# EAGLE design board (EAGLE 9.6.2)
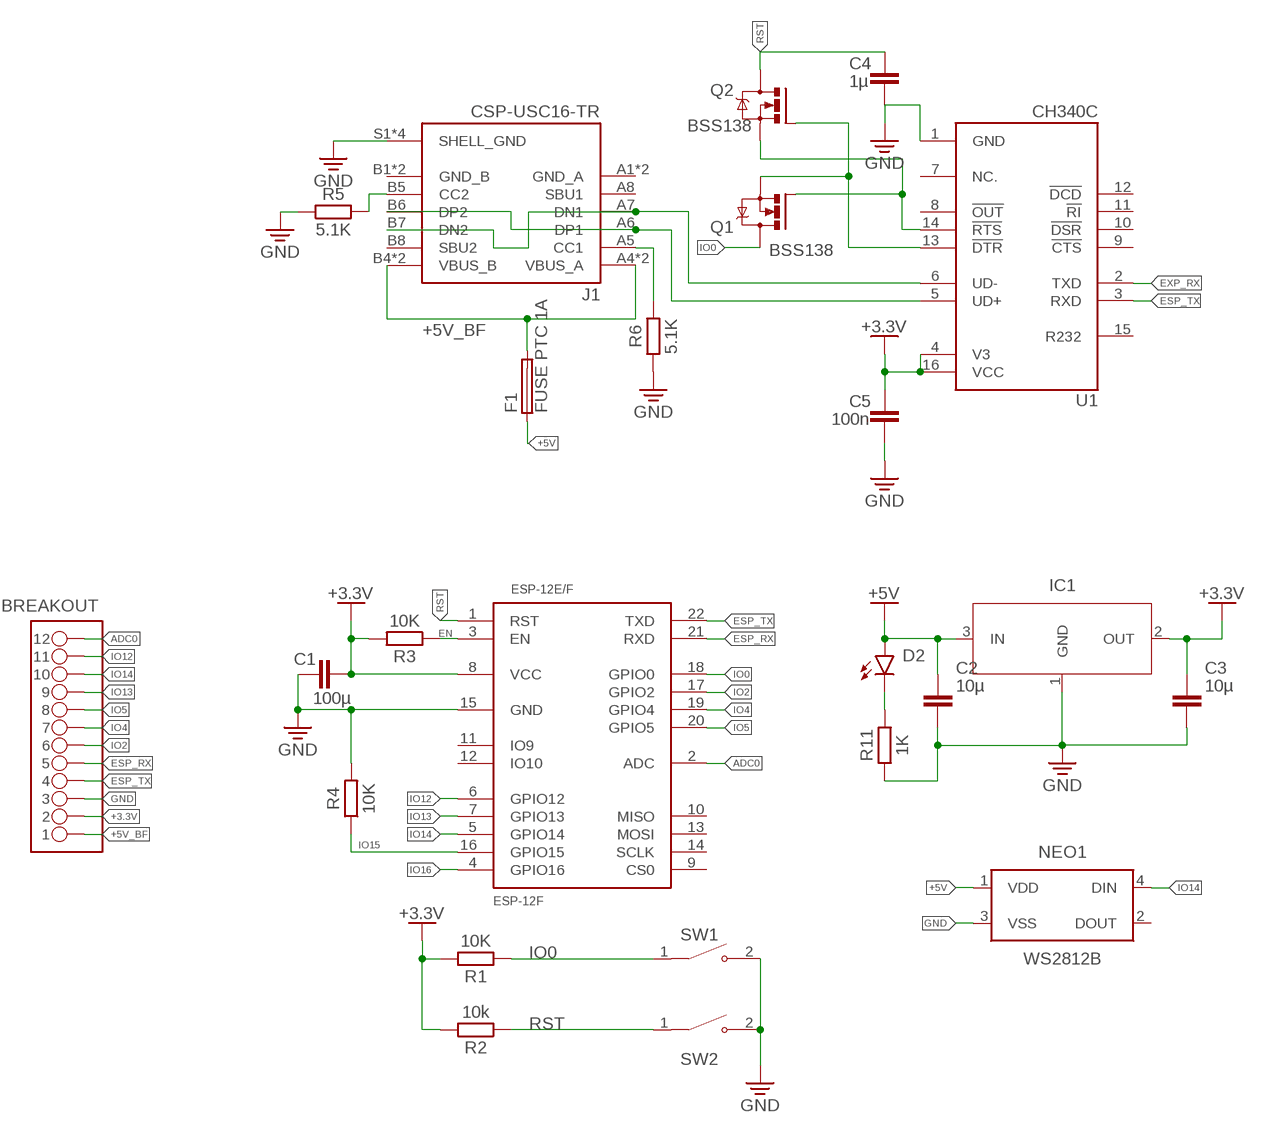
[diagram p0: schematic, sheet 1]

## Parts
BREAKOUT  PINHD-1X12-BACKUP_1X12M  [1X12]
C1  100µ  C_TANTALUM-2412(6032-METRIC)  [CAPM6032X280]
C2  10µ  C_CHIP-0805(2012-METRIC)  [CAPC2012X110]
C3  10µ  C_CHIP-0805(2012-METRIC)  [CAPC2012X110]
C4  1µ  C_CHIP-0805(2012-METRIC)  [CAPC2012X110]
C5  100n  C_CHIP-0805(2012-METRIC)  [CAPC2012X110]
D2  LED_RED  CHIP-FLAT-R_0805  [LEDC2012X110N_FLAT-R]
ESP-12E/F  ESP-12F  [ESP-12F]
F1  FUSE PTC 1A  FUSE_CHIP-1206(3216-METRIC)  [FUSC3215X82N]
IC1  NCP1117ST33T3G  NCP1117ST33T3GSOT-223  [SOT230P700X170-4]
J1  CSP-USC16-TR  [VALCON_CSP-USC16-TR]
NEO1  WS2812B  [WS2812B]
Q1  BSS138  NMOSFETSOT23-GSD  [SOT23]
Q2  BSS138  NMOSFETSOT23-GSD  [SOT23]
R1  10K  R_CHIP-0805(2012-METRIC)  [RESC2012X65]
R2  10k  R_CHIP-0805(2012-METRIC)  [RESC2012X65]
R3  10K  R_CHIP-0805(2012-METRIC)  [RESC2012X65]
R4  10K  R_CHIP-0805(2012-METRIC)  [RESC2012X65]
R5  5.1K  R_CHIP-0805(2012-METRIC)  [RESC2012X65]
R6  5.1K  R_CHIP-0805(2012-METRIC)  [RESC2012X65]
R11  1K  R_CHIP-0805(2012-METRIC)  [RESC2012X65]
SW1  SWITCH-2P  [SWITCH-2P]
SW2  SWITCH-2P  [SWITCH-2P]
U1  CH340C  [SOIC127P600X180-16N]

## Nets
+3.3V: BREAKOUT.2 C1.2 C3.1 C5.1 ESP-12E/F.8(VCC) IC1.2(OUT) R1.2 R2.2 R3.2 U1.4(V3) U1.16(VCC)
+5V: C2.1 D2.A F1.1 IC1.3(IN) NEO1.1(VDD)
+5V_BF: BREAKOUT.1 F1.2 J1.A4(VBUS_A) J1.A9(VBUS_A) J1.B4(VBUS_B) J1.B9(VBUS_B)
ADC0: BREAKOUT.12 ESP-12E/F.2(ADC)
EN: ESP-12E/F.3(EN) R3.1
ESP_RX: BREAKOUT.5 ESP-12E/F.21(RXD)
ESP_TX: BREAKOUT.4 ESP-12E/F.22(TXD) U1.3(RXD)
EXP_RX: U1.2(TXD)
GND: BREAKOUT.3 C1.1 C2.2 C3.2 C4.2 C5.2 ESP-12E/F.15(GND) IC1.1(GND) J1.S1(SHELL_GND) J1.S2(SHELL_GND) J1.S3(SHELL_GND) J1.S4(SHELL_GND) NEO1.3(VSS) R4.2 R5.1 R6.1 R11.1 SW1.2 SW2.2 U1.1(GND)
IO0: ESP-12E/F.18(GPIO0) Q1.3(D) R1.1 SW1.1
IO2: BREAKOUT.6 ESP-12E/F.17(GPIO2)
IO4: BREAKOUT.7 ESP-12E/F.19(GPIO4)
IO5: BREAKOUT.8 ESP-12E/F.20(GPIO5)
IO12: BREAKOUT.11 ESP-12E/F.6(GPIO12)
IO13: BREAKOUT.9 ESP-12E/F.7(GPIO13)
IO14: BREAKOUT.10 ESP-12E/F.5(GPIO14) NEO1.4(DIN)
IO15: ESP-12E/F.16(GPIO15) R4.1
IO16: ESP-12E/F.4(GPIO16)
N$1: J1.A6(DP1) J1.B6(DP2) U1.5(UD+)
N$2: J1.A7(DN1) J1.B7(DN2) U1.6(UD-)
N$4: Q1.2(S) Q2.1(G) U1.13(!DTR)
N$5: J1.B5(CC2) R5.2
N$6: J1.A5(CC1) R6.2
N$8: Q1.1(G) Q2.2(S) U1.14(!RTS)
N$9: D2.C R11.2
RST: C4.1 ESP-12E/F.1(RST) Q2.3(D) R2.1 SW2.1
Unconnected: ESP-12E/F.9(CS0) ESP-12E/F.10(MISO) ESP-12E/F.11(IO9) ESP-12E/F.12(IO10) ESP-12E/F.13(MOSI) ESP-12E/F.14(SCLK) J1.A8(SBU1) J1.B8(SBU2) NEO1.2(DOUT) U1.7(NC.) U1.8(!OUT) U1.9(!CTS) U1.10(!DSR) U1.11(!RI) U1.12(!DCD) U1.15(R232)

## Power pins joined to a net without a drawn wire
GND_A: J1.A1(GND_A) J1.A12(GND_A)
GND_B: J1.B1(GND_B) J1.B12(GND_B)

## Library data of the parts
BREAKOUT = Tinkercad:PINHD-1X12-BACKUP
C1-C5 = Capacitor:C: Capacitor - Generic; CATEGORY: Capacitor
D2 = LED:CHIP-FLAT-R; CATEGORY: LED; COLOR: RED; DESCRIPTION: CHIP LED FLAT; SUB-CATEGORY: CHIP; TYPE: FLAT_TOP
ESP-12E/F = WorTel2023:ESP-12F
F1 = Circuit-Protection:FUSE: Fuse - Generic; CATEGORY: Circuit-Protection; SUB-CATEGORY: Fuse
IC1 = IC_Power-Management:NCP1117ST33T3G: 1.0 A Low-Dropout Positive Fixed and Adjustable Voltage Regulators Datasheet <https://www.onsemi.com/pub/Collateral/NCP1117-D.PDF>; CATEGORY: IC_Power-Management; MANUFACTURER: ON Semiconductor; MPN: NCP1117ST33T3G; OPERATING_TEMP: 0 to +125 °C; PART_STATUS: Active; ROHS_COMPLIANT: RoHS3 Compliant; SERIES: NCP1117, NCV1117; SUB-CATEGORY: Voltage Regulator; TYPE: Linear
J1 = CSP-USC16-TR:CSP-USC16-TR: Check availability <https://pricing.snapeda.com/parts/CSP-USC16-TR/Valcon/view-part?ref=eda>; AVAILABILITY: In Stock; CHECK_PRICES: https://www.snapeda.com/parts/CSP-USC16-TR/Valcon/view-part/?ref=eda; DESCRIPTION: CSP-USC16-TR Valcon USB Type C Surface Mount PCB Socket; MF: Valcon; MP: CSP-USC16-TR; PACKAGE: None; PRICE: None; SNAPEDA_LINK: https://www.snapeda.com/parts/CSP-USC16-TR/Valcon/view-part/?ref=snap
NEO1 = LED:WS2812B: Intelligent control LED integrated light source Datasheet <http://cdn.sparkfun.com/datasheets/BreakoutBoards/WS2812B.pdf>; CATEGORY: LED; COLOR: RGB; DESCRIPTION: LED integrated light source; MANUFACTURER: Worldsemi; MPN: WS2812B; OPERATING_TEMP: -25 ℃ to +80℃(TJ); PART_STATUS: Active; SUB_CATEGORY: RGB
Q1 Q2 = Transistor:NMOSFET: N-Channel MOSFET - Generic; CATEGORY: Transistor; SUB-CATEGORY: MOSFET; TYPE: N-Channel; VALUE: NMOSFET
R1-R6 R11 = Resistor:R: Resistor Fixed - Generic; CATEGORY: Resistor; SUB-CATEGORY: Fixed
SW1 SW2 = WorTel2023:SWITCH-2P; MANUFACTURER: CUI Devices; MAXIMUM_PACKAGE_HEIGHT: 2.5 mm; PARTREV: 1.0; STANDARD: Manufacturer Recommendations
U1 = CH340C:CH340C: USB to serial chip CH340 Check availability <https://pricing.snapeda.com/parts/CH340C/WCH/view-part?ref=eda>; AVAILABILITY: Not in stock; CHECK_PRICES: https://www.snapeda.com/parts/CH340C/WCH/view-part/?ref=eda; DESCRIPTION: USB to serial chip CH340; MF: WCH; MP: CH340C; PACKAGE: None; PRICE: None; SNAPEDA_LINK: https://www.snapeda.com/parts/CH340C/WCH/view-part/?ref=snap

## Board
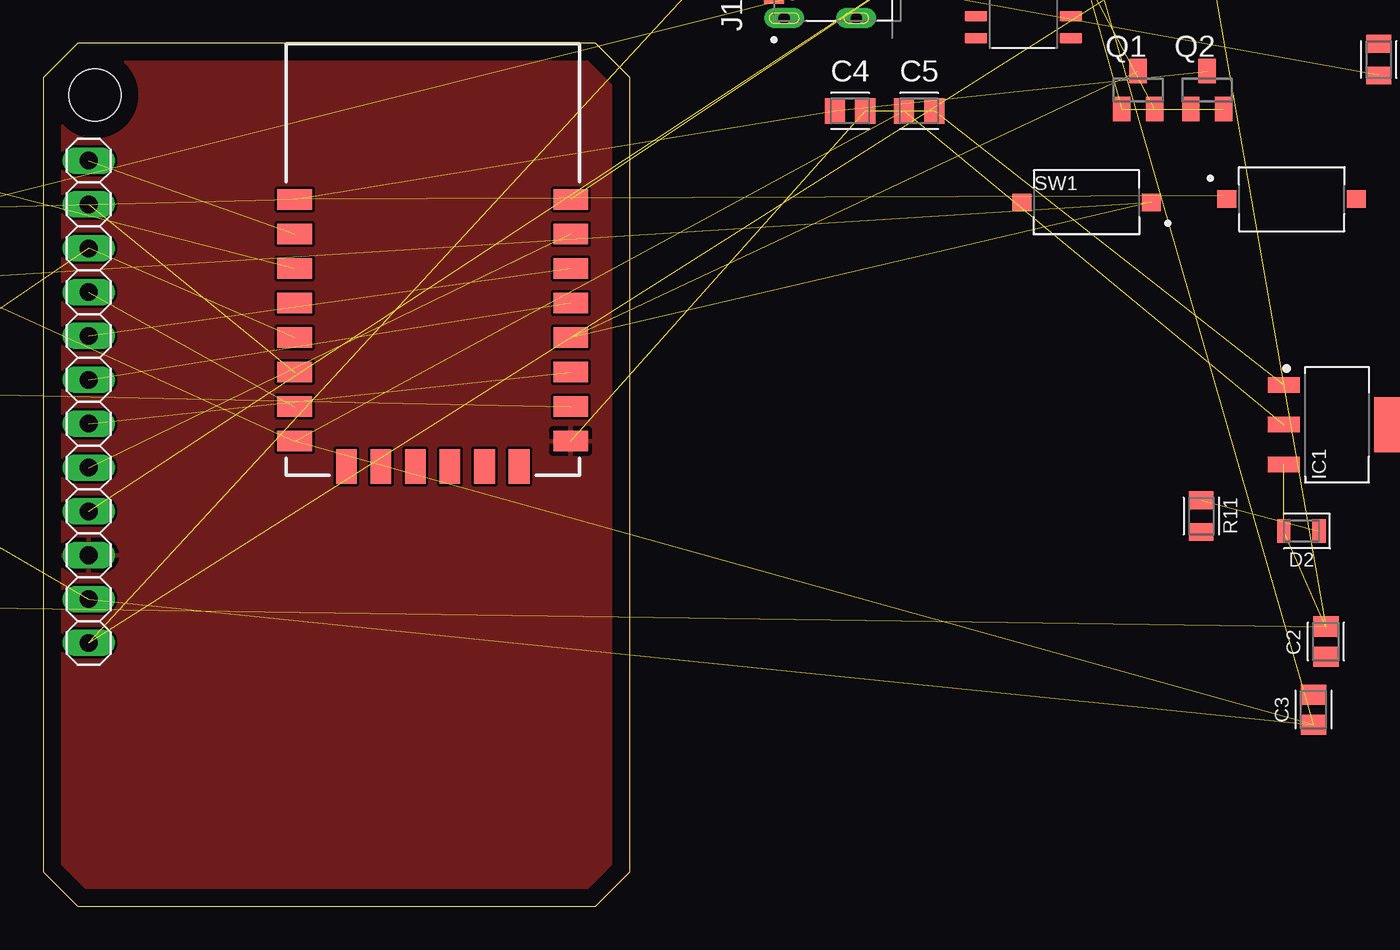
[diagram p1: board, top side]
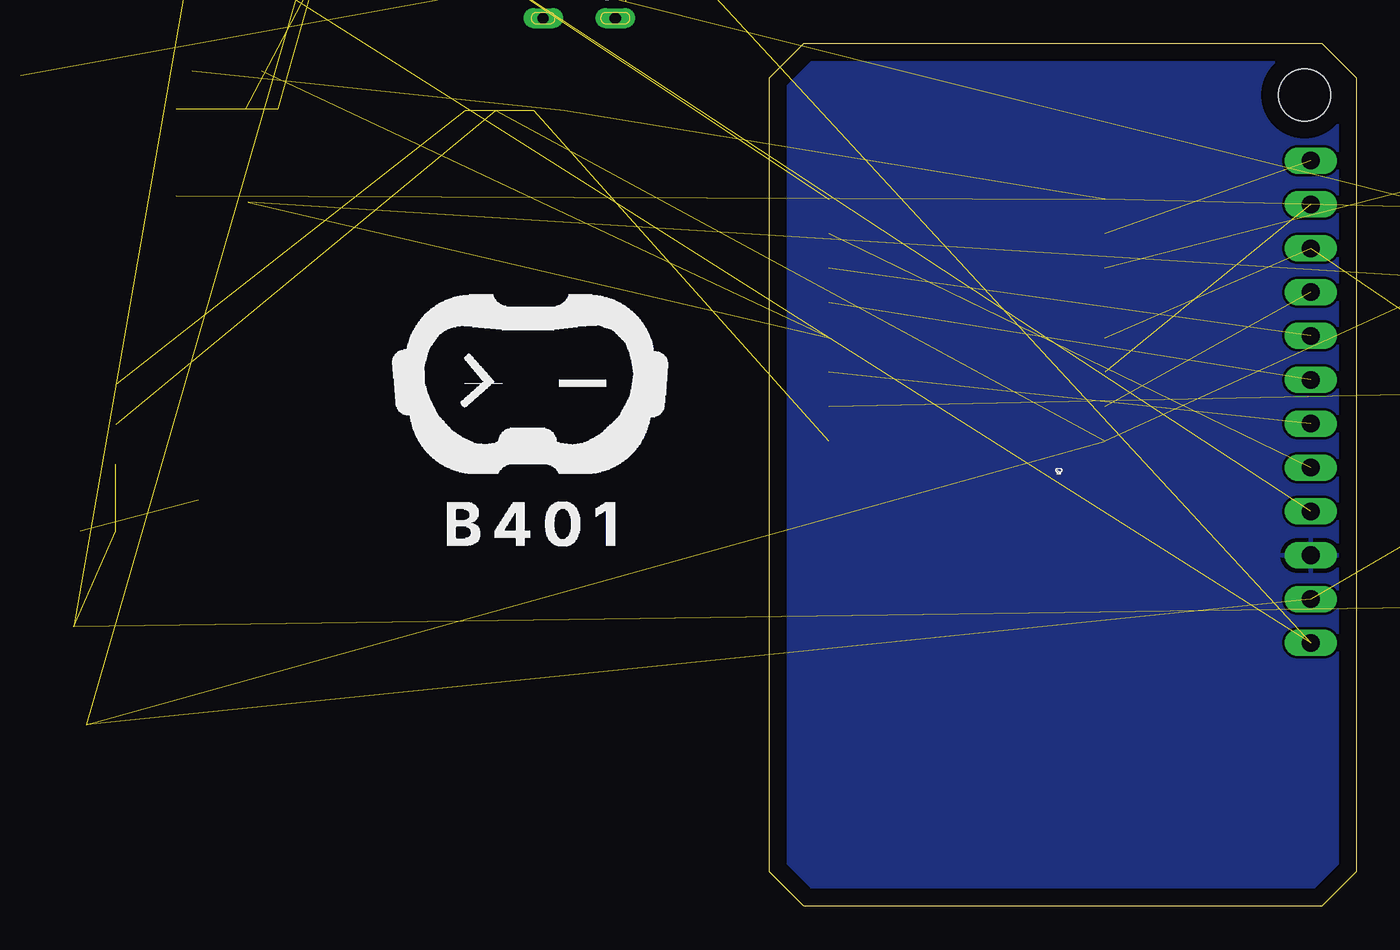
[diagram p2: board, bottom side, seen from below]

Size 34 x 50 mm. Coordinates in mm from the lower left corner, seen from the top.
Outline: 2,0 32,0 34,2 34,48 32,50 2,50 0,48 0,2 2,0
Copper layers (1*16): Top 0.035mm / dielectric 1.5mm / Bottom 0.035mm
Design rules "default *": minimum track width 6mil, minimum drill 0.3mm, track to track 6mil, track to pad 6mil, pad to pad 6mil, via to via 6mil, smd to smd 6mil, copper to edge 40mil, drill to drill 6mil, minimum pad ring 10mil, minimum via ring 8mil, stop-mask expansion 4mil, vias tented up to drill 0mil, thermal gap 10mil
Holes 3 mm at 3,47

### Footprints (pad centres in the part's own frame; a part is rotated, then mirrored left to right if it is on the bottom)
1X12 = drill 1.016 long: 1 -13.97,0; 2 -11.43,0; 3 -8.89,0; 4 -6.35,0; 5 -3.81,0; 6 -1.27,0; 7 1.27,0; 8 3.81,0; 9 6.35,0; 10 8.89,0; 11 11.43,0; 12 13.97,0
CAPM6032X280 = smd 2.368 x 2.204: 1 -2.471,0; 2 2.471,0
CAPC2012X110 = smd 1.165 x 1.465: 1 -0.875,0; 2 0.875,0
LEDC2012X110N_FLAT-R = smd 0.762 x 1.362: A 1.025,0; C -1.025,0
ESP-12F = smd 2 x 1.2: 1 -8,3.48; 2 -8,1.48; 3 -8,-0.52; 4 -8,-2.52; 5 -8,-4.52; 6 -8,-6.52; 7 -8,-8.52; 8 -8,-10.52; 15 8,-10.52; 16 8,-8.52; 17 8,-6.52; 18 8,-4.52; 19 8,-2.52; 20 8,-0.52; 21 8,1.48; 22 8,3.48 | smd 1.2 x 2: 9 -5,-12; 10 -3,-12; 11 -1,-12; 12 1,-12; 13 3,-12; 14 5,-12
FUSC3215X82N = smd 1.165 x 1.814: 1 -1.475,0; 2 1.475,0
SOT230P700X170-4 = smd 1.86 x 0.898: 1 -3.075,2.3; 2 -3.075,0; 3 -3.075,-2.3 | smd 1.86 x 3.189: 4 3.075,0
VALCON_CSP-USC16-TR = smd 0.3 x 1.14: A1 -3.35,0; A4 -2.55,0; A5 -1.25,0; A6 -0.25,0; A7 0.25,0; A8 1.25,0; A9 2.55,0; A12 3.35,0; B1 3.05,0; B4 2.25,0; B5 1.75,0; B6 0.75,0; B7 -0.75,0; B8 -1.75,0; B9 -2.25,0; B12 -3.05,0 | drill 0.65 pad 1 long: S1 -4.325,-0.59; S2 4.325,-0.59 | drill 0.65 pad 0.9 long: S3 -4.325,-4.77; S4 4.325,-4.77 | hole 0.65: -2.89,-1.07; 2.89,-1.07
WS2812B = smd 1.5 x 0.9: 1 -2.45,1.65; 2 -2.45,-1.65; 3 2.45,-1.65; 4 2.45,1.65
SOT23 = smd 1 x 1.4: 1 -0.95,-1.1; 2 0.95,-1.1; 3 0,1.1
RESC2012X65 = smd 1.031 x 1.42: 1 -0.919,0; 2 0.919,0
SWITCH-2P = smd 1.1 x 1: 1 -3.75,0; 2 3.75,0
SOIC127P600X180-16N = smd 1.31 x 0.62: 1 -2.75,4.445; 2 -2.75,3.175; 3 -2.75,1.905; 4 -2.75,0.635; 5 -2.75,-0.635; 6 -2.75,-1.905; 7 -2.75,-3.175; 8 -2.75,-4.445; 9 2.75,-4.445; 10 2.75,-3.175; 11 2.75,-1.905; 12 2.75,-0.635; 13 2.75,0.635; 14 2.75,1.905; 15 2.75,3.175; 16 2.75,4.445

### Placement (x,y rotation side)
BREAKOUT  2.64,29.23 90 top
C1  -18.06,37.87 0 top  (outside the outline)
C2  74.33,15.34 270 top  (outside the outline)
C3  73.6,11.39 90 top  (outside the outline)
C4  46.75,46.08 0 top  (outside the outline)
C5  50.76,46.08 0 top  (outside the outline)
D2  72.9,21.74 180 top  (outside the outline)
ESP-12E/F  22.57,37.47 0 top
F1  66.14,54.58 180 top  (outside the outline)
IC1  74.97,27.91 0 top  (outside the outline)
J1  42.34,55.77 90 top  (outside the outline)
NEO1  -29.84,16.05 0 top  (outside the outline)
Q1  63.44,47.28 0 top  (outside the outline)
Q2  67.44,47.28 0 top  (outside the outline)
R1  -29.77,35.74 90 top  (outside the outline)
R2  -30.27,40.74 90 top  (outside the outline)
R3  -26.64,46.62 270 top  (outside the outline)
R4  -27.31,30.14 180 top  (outside the outline)
R5  79.38,53.91 90 top  (outside the outline)
R6  77.38,49.05 270 top  (outside the outline)
R11  67.1,22.61 90 top  (outside the outline)
SW1  60.45,40.78 180 top  (outside the outline)
SW2  72.34,40.97 0 top  (outside the outline)
U1  56.79,54.73 0 top  (outside the outline)

### Tracks (layer width: path | path; a pad name or v marks a point on that pad's centre or on a via)
+3.3V  (10 unrouted)
+5V  (4 unrouted)
+5V_BF  (5 unrouted)
ADC0  (1 unrouted)
EN  (1 unrouted)
ESP_RX  (1 unrouted)
ESP_TX  (2 unrouted)
GND  (3 unrouted)
  pour Top: -0.27,48.13 -0.27,1.62 1.85,-0.51 32.15,-0.51 34.58,1.92 34.58,48.08 32.26,50.4 2,50.4
  pour Bottom: -0.27,48.13 -0.27,1.62 1.85,-0.51 32.15,-0.51 34.58,1.92 34.58,48.08 32.26,50.4 2,50.4
GND_A  (1 unrouted)
GND_B  (1 unrouted)
IO0  (3 unrouted)
IO2  (1 unrouted)
IO4  (1 unrouted)
IO5  (1 unrouted)
IO12  (1 unrouted)
IO13  (1 unrouted)
IO14  (2 unrouted)
IO15  (1 unrouted)
N$1  (2 unrouted)
N$2  (2 unrouted)
N$4  (2 unrouted)
N$5  (1 unrouted)
N$6  (1 unrouted)
N$8  (2 unrouted)
N$9  (1 unrouted)
RST  (4 unrouted)
  Top 0.152: SW2.1 68.39,41.17

### Text on the board
tPlace: Designed by B401 | Robotics and Intelligent / System
bPlace: D:/Data/Downloads/2024/4/logo.bmp